# Altium project Master_uC_PCB.PrjPcb (part 1 of 2)
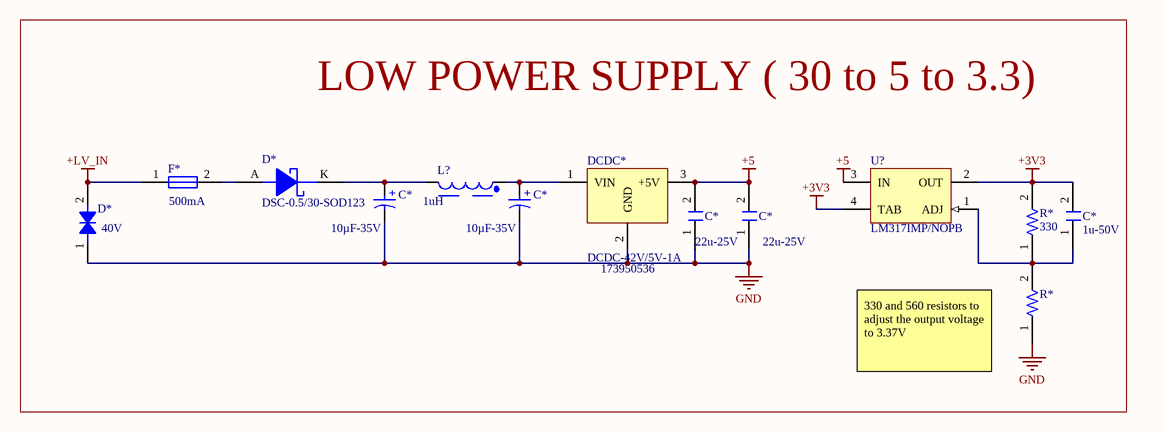
[diagram p0: [1]Supply.SchDoc]
5 sheets, 90 parts. Net scope: flat (ports and power ports of the same name join across sheets).
Sheets:
  [1]Supply.SchDoc
  [2]STM32L4.SchDoc
  [3]CAN_Communication.SchDoc
  [4]isoSPI.SchDoc
  [5]Cooling_Control.SchDoc

## Sheet [1]Supply.SchDoc
size A4; SheetNumber: 3; SheetTotal: 6

### Parts
(Parts that share a designator on the sheet are numbered #1, #2 ... from top to bottom, then left to right.)
?#1  (no value)  (graphical)
C*#1  value 10µF-35V  [865080540004-Footprint-1]  (hidden comment: 865080540004)
C*#2  value 10µF-35V  [865080540004-Footprint-1]  (hidden comment: 865080540004)
C*#3  22u-25V  [0805]
C*#4  22u-25V  [0805]
C*#5  1u-50V  [C0805FNPC-R]
D*#1  DSC-0.5/30-SOD123  [DSC-SOD123]
D*#2  Capacitance: 40V  [DTVS-DO-214AB]  (hidden comment: DTVS-40V-DO-214AB)
DCDC*  DCDC-42V/5V-1A  Part Number: 173950536  [DCDC_Magi3c]
F*  Current Rating: 500mA  [0805]  (hidden comment: MFU0805FF00500P500)
L?  value 1uH  [WE-PD2_4532]  (hidden comment: 7447730)
R*#1  330  [0805]
R*#2  560  [0805]  (value not drawn)
U?  LM317IMP/NOPB  [DCY0004A_M]

### Blocks framed on the sheet
LOW POWER SUPPLY ( 30 to 5 to 3.3): C*#1-C*#5 D*#1 D*#2 DCDC* F* L? R*#1 R*#2 U?

### Nets
+3V3: C*#5.2 R*#1.2 U?.2(OUT) U?.4(TAB)
+5: C*#3.2 C*#4.2 DCDC*.3(+5V) U?.3(IN)
+LV_IN: D*#2.2 F*.1
GND: C*#1.2(N) C*#2.2(N) C*#3.1 C*#4.1 D*#2.1 DCDC*.2(GND) R*#2.1
NetC*#1_1: C*#1.1(P) D*#1.K L?.2
NetC*#2_1: C*#2.1(P) DCDC*.1(VIN) L?.1
NetC*#5_1: C*#5.1 R*#1.1 R*#2.2 U?.1(ADJ)
NetD*#1_A: D*#1.A F*.2

### Notes on the sheet
- (near R*#2) 330 and 560 resistors to adjust the output voltage to 3.37V
- Size:
- Company:
- Project:
- Page Contents:
- Variant:
- Version:
- Checked by:
- Author:
- Sheet
- Date:
- Department:
- of
- (in symbol CMP-001-00019-1) +

### Library data of the parts
?#1 = CMP-00043-6: Standard Title Block
C*#1 C*#2 = CMP-001-00019-1: WCAP-ASLI Aluminum Electrolytic Capacitors; Tolerance: 20%; Ripple Current (AC): 90mA; Voltage Rating: 35V; Min Operating Temperature: -55°C; Max Operating Temperature: 105°C; Case/Package: Radial; Ripple Current: 90mA; Mounting Technology: Surface Mount; RoHS Compliant: Yes
C*#3 C*#4 = CMP-001-00018-1: Ceramic Capacitor, Multilayer, Ceramic, 25V, 20% +Tol, 20% -Tol, X5R, 15% TC, 22uF, Surface Mount, 1210; Value: 22µF; Min Operating Temperature: -55°C; Max Operating Temperature: 85°C; RoHS Compliant: Yes; Pins: 2; Case/Package: 1210; Mounting Technology: Surface Mount; Capacitor Type: Ceramic
C*#5 = CMP-00052-1: Multilayer Ceramic Capacitor, Wcap-Csgp Series, 1 F, 10%, X7R, 50 V, 0805 [2012 Metric] Rohs Compliant: Yes; Manufacturer Part Number 1: 885012207103; Manufacturer 1: Wurth Electronics; Voltage Rating (DC): 50V; Value: 1µF; .Creator: GP; Max Operating Temperature: 85°C; Case/Package: 0805; ComponentLink1Description: http://www.farnell.com/datasheets/1958501.pdf?src-supplier=Farnell; Design Item ID: C1u-50V-0805FNPC-X7R; ComponentLink1URL: http://www.farnell.com/datasheets/1958501.pdf?src-supplier=Farnell; ComponentLink2Description: http://www.farnell.com/datasheets/1958501.pdf?src-supplier=Element14; ComponentLink3URL: https://katalog.we-online.de/pbs/datasheet/885012107003.pdf?src-supplier=Digi-Key; ComponentLink4Description: http://www.farnell.com/datasheets/1958501.pdf?src-supplier=Newark; Width: 0.049inch; RoHS Compliant: Yes; Case Code (Metric): 2012; Source: Passives.SchLib; Category: Ceramic Capacitors; Tolerance: 10%; Pricing 1: 50=0,27200, 250=0,25300, 500=0,22800, 1250=0,20100, 2500=0,17100 (GBP); RoHS: Yes; Mount: Surface Mount; Min Operating Temperature: -55°C; ComponentLink4URL: http://www.farnell.com/datasheets/1958501.pdf?src-supplier=Newark; Dielectric: X7R; ComponentLink3Description: https://katalog.we-online.de/pbs/datasheet/885012107003.pdf?src-supplier=Digi-Key; ComponentLink2URL: http://www.farnell.com/datasheets/1958501.pdf?src-supplier=Element14; REACH SVHC: Unknown; Length: 0.079inch; Packaging: Cut Tape; Thickness: 0.053inch; Stock 1: 5100; Voltage Rating: 50V
D*#1 = CMP-00165-1: VR=30V IF=500mA 30pF P=410mW; Max Reverse Leakage Current: 130uA; .Creator: GP; Max Reverse Voltage (DC): 30V; Element Configuration: Single; Average Rectified Current: 500mA; Peak Non-Repetitive Surge Current: 5.5A; Polarity: Standard; Forward Voltage: 430mV; ComponentLink10Description: https://datasheet.ciiva.com/910/mbr0530-910518.pdf?src-supplier=Digi-Key; ComponentLink1Description: Datasheet; Category: Diode; ComponentLink3Description: https://datasheet.ciiva.com/30479/0900766b810e2512-30479401.pdf?src-supplier=RSComponents; ComponentLink5Description: https://datasheet.ciiva.com/910/mbr0530-910516.pdf?src-supplier=Digi-Key; Stock 1: 9; Weight: 0.03g; Source: Filter components.SchLib; ComponentLink2Description: Where buy it; Series: -; Mount: Surface Mount; Max Repetitive Reverse Voltage (Vrrm): 30V; Pricing 1: 1=0,34400, 10=0,23900, 100=0,12200, 500=0,10000 (USD); Design Item ID: DSC-0.5/30-SOD123; ComponentLink8Description: https://datasheet.ciiva.com/17318/mbr0530-17318568.pdf?src-supplier=Future+Electronics; Current Rating: 500mA; ComponentLink1URL: *; Length: 2.7mm; Max Reverse Current: 130uA; ComponentLink7URL: https://datasheet.ciiva.com/8300/mbr0530-8300905.pdf?src-supplier=Avnet; ComponentLink9URL: https://datasheet.ciiva.com/15144/getdatasheetpartid-86760-15144598.pdf?src-supplier=Verical; Radiation Hardening: No; Height: 1.03mm; ComponentLink4Description: https://datasheet.ciiva.com/34301/974753-34301826.pdf?src-supplier=Jameco; ComponentLink7Description: https://datasheet.ciiva.com/8300/mbr0530-8300905.pdf?src-supplier=Avnet; Package Quantity: 1; Forward Current: 500mA; ComponentLink5URL: https://datasheet.ciiva.com/910/mbr0530-910516.pdf?src-supplier=Digi-Key; Max Surge Current: 5.5A; Lead Free: Lead Free; ComponentLink2URL: *; Max Forward Surge Current (Ifsm): 5.5A; Output Current: 500mA; Voltage Rating (DC): 30V; Contact Plating: Tin,Matte; RoHS Compliant: Yes; REACH SVHC: No SVHC; ComponentLink10URL: https://datasheet.ciiva.com/910/mbr0530-910518.pdf?src-supplier=Digi-Key; ComponentLink4URL: https://datasheet.ciiva.com/34301/974753-34301826.pdf?src-supplier=Jameco; ComponentLink6URL: https://datasheet.ciiva.com/25931/mbr0530-25931989.pdf?src-supplier=Avnet+Europe; ComponentLink6Description: https://datasheet.ciiva.com/25931/mbr0530-25931989.pdf?src-supplier=Avnet+Europe; Width: 1.6mm; ComponentLink3URL: https://datasheet.ciiva.com/30479/0900766b810e2512-30479401.pdf?src-supplier=RSComponents; ComponentLink9Description: https://datasheet.ciiva.com/15144/getdatasheetpartid-86760-15144598.pdf?src-supplier=Verical; ComponentLink8URL: https://datasheet.ciiva.com/17318/mbr0530-17318568.pdf?src-supplier=Future+Electronics
D*#2 = CMP-00157-1: TVS diode [Würth Elektronik] 824551301 TVS diode; Manufacturer: Wurth Electronics; Number of Bidirectional Channels: 1; .Creator: DO; Peak Pulse Current: 62A; Power Line Protection: No; Forward Voltage: 35.05V; Polarity: Bidirectional; Reverse Standoff Voltage: 30V; Peak Pulse Power: 3kW; Clamping Voltage: 48.4V; Stock 1: 1; Category: TVS Diodes; Manufacturer Part Number: 824551301; Resistor Type: Zener; Design Item ID: DTVS-40V-DO-214AB; ComponentLink1URL: http://www.farnell.com/datasheets/2036459.pdf?src-supplier=Element14; Min Operating Temperature: -65°C; ComponentLink2Description: Where buy it; RoHS: Yes; REACH SVHC: Unknown; Pins: 2; ComponentLink2URL: https://www.we-online.com/catalog/en/WE-TVSP?sq=824551301#824551301; Min Breakdown Voltage: 35.05V; RoHS Compliant: Yes; Pricing 1: 10=1,72500, 50=1,54700, 100=1,45300, 250=1,35100, 500=1,15000 (USD); Max Operating Temperature: 150°C; Packaging: Cut Tape; Source: Filter components.SchLib; ComponentLink1Description: http://www.farnell.com/datasheets/2036459.pdf?src-supplier=Element14; Mount: Surface Mount
DCDC* = CMP-00116-1: Würth Elektronik 8-42V to 5V 1A DC-DC; Manufacturer 1: Wurth Electronics; Manufacturer Part Number 1: 173010542; Efficiency: 93%; Min Input Voltage: 8V; .Creator: DR; Max Input Voltage: 42V; Number of Outputs: 1; Packaging: Rail/Tube; RoHS Compliant: Yes; RoHS: Yes; Voltage - Output 1: 5V; Stock 1: 1; ComponentLink3Description: https://katalog.we-online.de/pm/datasheet/173010542.pdf?src-supplier=Digi-Key; Max Output Current: 1A; Min Operating Temperature: -40°C; Features: UVLO,OCP,OTP,SCP; Design Item ID: DCDC-42V/5V-1A; Pricing 1: 1=12,22500, 8=10,96900, 21=10,68900 (USD); ComponentLink3URL: https://katalog.we-online.de/pm/datasheet/173010542.pdf?src-supplier=Digi-Key; Max Operating Temperature: 85°C; ComponentLink2Description: http://www.farnell.com/datasheets/2192895.pdf?src-supplier=Newark; ComponentLink1URL: http://www.farnell.com/datasheets/2192895.pdf?src-supplier=Farnell; ComponentLink1Description: http://www.farnell.com/datasheets/2192895.pdf?src-supplier=Farnell; Source: Semiconductor.SchLib; ComponentLink2URL: http://www.farnell.com/datasheets/2192895.pdf?src-supplier=Newark; Mount: Through Hole
F* = CMP-001-00020-1: Fuse, 24 Milliohms to 660 Milliohms (Cold) @ 0.1, 32 V, 0805, 15 C, 35 C; Value: 0.5A-50V; Max Operating Temperature: 125°C; Pins: 2; Case/Package: 0805; Mounting Technology: Surface Mount,PCB; RoHS Compliant: Yes; Min Operating Temperature: 15°C
L? = CMP-006-00005-1: General Purpose Inductor, 1uH, 20%, 1 Element, Nickel-zinc Ferrite-Core, SMD, 1816; Self Resonant Frequency: 110MHz; Max Current Rating: 4A; RoHS Compliant: Yes; Tolerance: 20%; Min Operating Temperature: -40°C; Pins: 2; Max Operating Temperature: 125°C
R*#1 = CMP-009-00024-1: Fixed Resistor, Metal Glaze/thick Film, 0.5W, 330ohm, 150V, 1% +/-Tol, 100ppm/Cel, Surface Mount, 0805; Power: 500mW; Max Operating Temperature: 155°C; Min Operating Temperature: -55°C; Pins: 2; RoHS Compliant: Yes; Value: 330; Case/Package: 0805; Mounting Technology: Surface Mount; Tolerance: 1%
R*#2 = CMP-009-00025-1: Fixed Resistor, Metal Glaze/thick Film, 0.5W, 560ohm, 150V, 1% +/-Tol, 100ppm/Cel, Surface Mount, 0805; Power: 500mW; Mounting Technology: Surface Mount; Tolerance: 1%; Case/Package: 0805; Max Operating Temperature: 155°C; RoHS Compliant: Yes; Min Operating Temperature: -55°C; Pins: 2; Value: 560
U? = CMP-019-00004-1: Linear Voltage Regulator IC Positive Adjustable 1 Output 1.25 V ~ 37 V 1A SOT-223-4

## Sheet [2]STM32L4.SchDoc
size A4; SheetNumber: 2; SheetTotal: 6
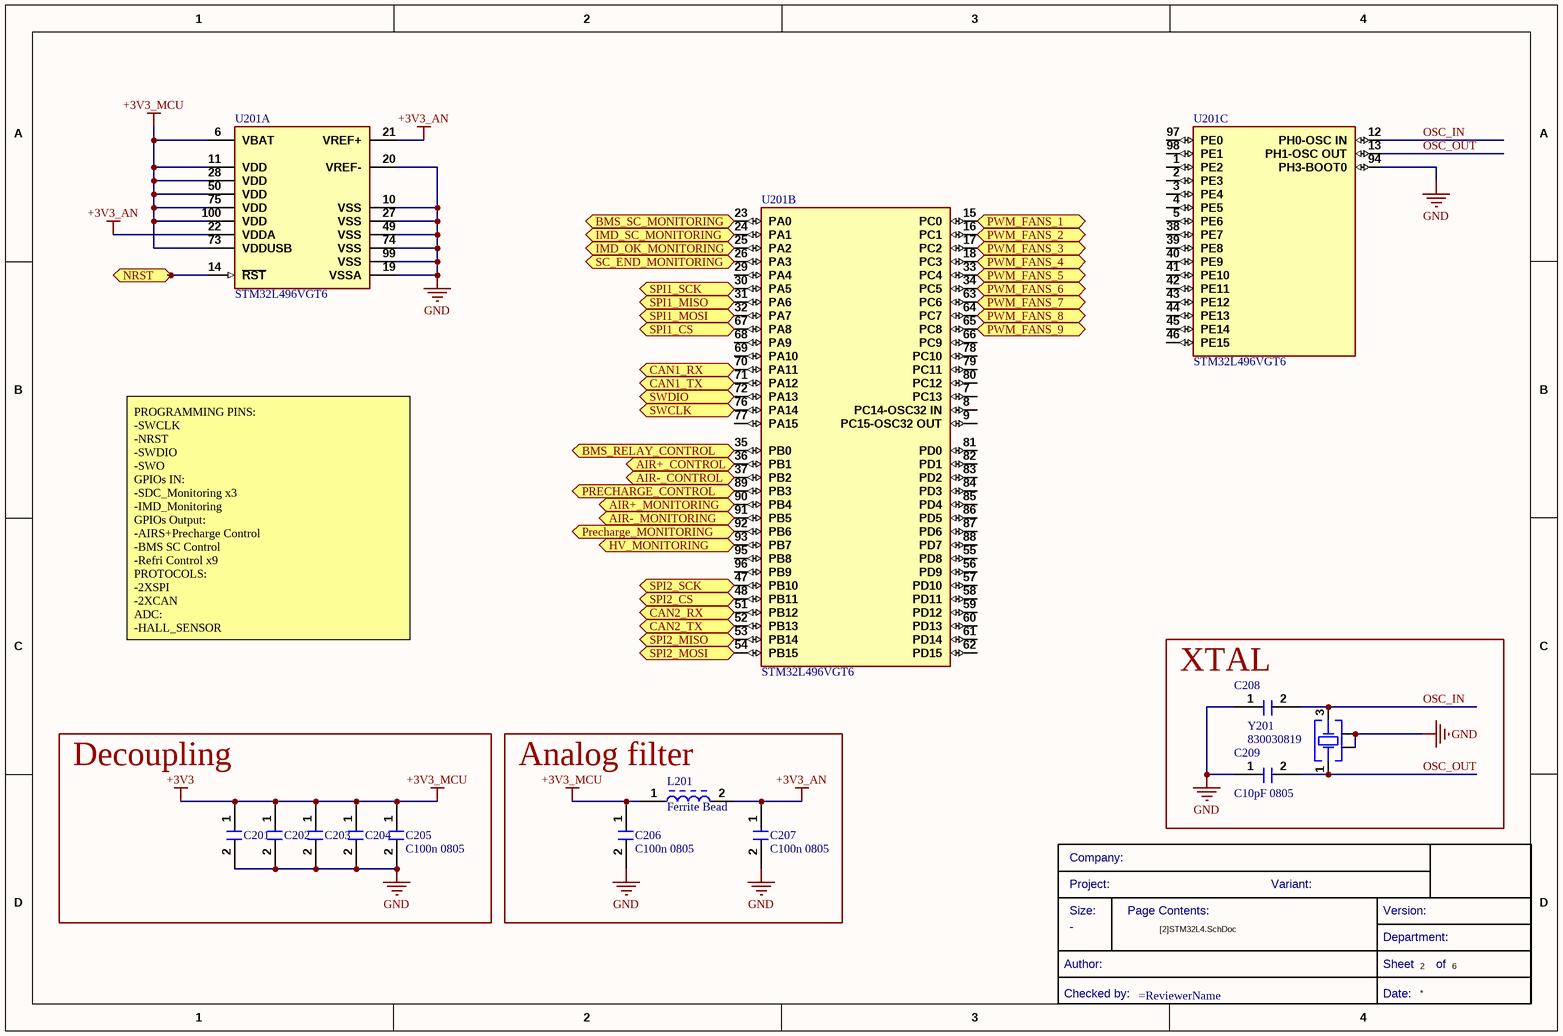
[diagram p1: [2]STM32L4.SchDoc]

### Parts
(Parts that share a designator on the sheet are numbered #1, #2 ... from top to bottom, then left to right.)
?#2  (no value)  (graphical)
C201  C100n 0805  [C0805FNPC-R]  (value not drawn)
C202  C100n 0805  [C0805FNPC-R]  (value not drawn)
C203  C100n 0805  [C0805FNPC-R]  (value not drawn)
C204  C100n 0805  [C0805FNPC-R]  (value not drawn)
C205  C100n 0805  [C0805FNPC-R]
C206  C100n 0805  [C0805FNPC-R]
C207  C100n 0805  [C0805FNPC-R]
C208  C10pF 0805  [WCAP-CSGP_0805_L2W1.25H0.6_Reflow]
C209  C10pF 0805  [WCAP-CSGP_0805_L2W1.25H0.6_Reflow]  (value not drawn)
L201  Ferrite Bead  [L_Ferrite_bead_0805]
U201  STM32L496VGT6  [FP-LQFP100-1L-IPC_A]  (parts A,B,C of 3)
Y201  830030819  [WE-XTAL_CFPX-104]

### Blocks framed on the sheet
XTAL: C208 C209 Y201
Decoupling: C201-C205
Analog filter: C206 C207 L201

### Ports
AIR+_CONTROL (bidir, see Master_uC_PCB.SchDoc[1B]), AIR+_MONITORING (bidir, see Master_uC_PCB.SchDoc[1A]), AIR-_CONTROL (bidir, see Master_uC_PCB.SchDoc[1B]), AIR-_MONITORING (bidir, see Master_uC_PCB.SchDoc[1A]), BMS_RELAY_CONTROL (bidir, see Master_uC_PCB.SchDoc[1A]), BMS_SC_MONITORING (bidir, see Master_uC_PCB.SchDoc[1A]), CAN1_RX (bidir, see Master_uC_PCB.SchDoc[2A], [3]CAN_Communication[1A]), CAN1_TX (bidir, see Master_uC_PCB.SchDoc[2A], [3]CAN_Communication[1B]), CAN2_RX (bidir, see Master_uC_PCB.SchDoc[2A], [3]CAN_Communication[1A]), CAN2_TX (bidir, see Master_uC_PCB.SchDoc[2A], [3]CAN_Communication[1A]), HV_MONITORING (bidir, see Master_uC_PCB.SchDoc[1A]), IMD_OK_MONITORING (bidir, see Master_uC_PCB.SchDoc[1A]), IMD_SC_MONITORING (bidir, see Master_uC_PCB.SchDoc[1A]), NRST (bidir, see Master_uC_PCB.SchDoc[2B]), PRECHARGE_CONTROL (bidir, see Master_uC_PCB.SchDoc[1B]), Precharge_MONITORING (bidir, see Master_uC_PCB.SchDoc[1A]), PWM_FANS_1 (bidir, see Master_uC_PCB.SchDoc[1B], [5]Cooling_Control[4A]), PWM_FANS_2 (bidir, see Master_uC_PCB.SchDoc[1B], [5]Cooling_Control[4A]), PWM_FANS_3 (bidir, see Master_uC_PCB.SchDoc[1B], [5]Cooling_Control[4A]), PWM_FANS_4 (bidir, see Master_uC_PCB.SchDoc[1B], [5]Cooling_Control[4A]), PWM_FANS_5 (bidir, see Master_uC_PCB.SchDoc[1B], [5]Cooling_Control[4B]), PWM_FANS_6 (bidir, see Master_uC_PCB.SchDoc[1B], [5]Cooling_Control[4B]), PWM_FANS_7 (bidir, see Master_uC_PCB.SchDoc[1B], [5]Cooling_Control[4B]), PWM_FANS_8 (bidir, see Master_uC_PCB.SchDoc[1B], [5]Cooling_Control[4B]), PWM_FANS_9 (bidir, see Master_uC_PCB.SchDoc[1B], [5]Cooling_Control[4B]), SC_END_MONITORING (bidir, see Master_uC_PCB.SchDoc[1A]), SPI1_CS (bidir, see Master_uC_PCB.SchDoc[2A], [4]isoSPI[1A]), SPI1_MISO (bidir, see Master_uC_PCB.SchDoc[2A], [4]isoSPI[1A]), SPI1_MOSI (bidir, see Master_uC_PCB.SchDoc[2A], [4]isoSPI[1A]), SPI1_SCK (bidir, see Master_uC_PCB.SchDoc[2A], [4]isoSPI[1A]), SPI2_CS (bidir, see Master_uC_PCB.SchDoc[2B], [4]isoSPI[1B]), SPI2_MISO (bidir, see Master_uC_PCB.SchDoc[2B], [4]isoSPI[1B]), SPI2_MOSI (bidir, see Master_uC_PCB.SchDoc[2B], [4]isoSPI[1B]), SPI2_SCK (bidir, see Master_uC_PCB.SchDoc[2A], [4]isoSPI[1A]), SWCLK (bidir, see Master_uC_PCB.SchDoc[2B]), SWDIO (bidir, see Master_uC_PCB.SchDoc[2B])

### Nets
+3V3: C201.1 C202.1 C203.1 C204.1 C205.1 C206.1 L201.1 U201.6(VBAT) U201.11(VDD) U201.28(VDD) U201.50(VDD) U201.73(VDDUSB) U201.75(VDD) U201.100(VDD)  [also labelled +3V3_MCU]
+3V3_AN: C207.1 L201.2 U201.21(VREF+) U201.22(VDDA)
GND: C201.2 C202.2 C203.2 C204.2 C205.2 C206.2 C207.2 C208.1 C209.1 U201.10(VSS) U201.19(VSSA) U201.20(VREF-) U201.27(VSS) U201.49(VSS) U201.74(VSS) U201.94(PH3-BOOT0) U201.99(VSS) Y201.2(GND_&_Lid) Y201.4(GND_&_Lid)
CAN1_RX: U201.70(PA11) ; port CAN1_RX
CAN1_TX: U201.71(PA12) ; port CAN1_TX
CAN2_RX: U201.51(PB12) ; port CAN2_RX
CAN2_TX: U201.52(PB13) ; port CAN2_TX
OSC_IN: C208.2 U201.12(PH0-OSC_IN) Y201.3(Crystal)
OSC_OUT: C209.2 U201.13(PH1-OSC_OUT) Y201.1(Crystal)
PWM_FANS_1: U201.15(PC0) ; port PWM_FANS_1
PWM_FANS_2: U201.16(PC1) ; port PWM_FANS_2
PWM_FANS_3: U201.17(PC2) ; port PWM_FANS_3
PWM_FANS_4: U201.18(PC3) ; port PWM_FANS_4
PWM_FANS_5: U201.33(PC4) ; port PWM_FANS_5
PWM_FANS_6: U201.34(PC5) ; port PWM_FANS_6
PWM_FANS_7: U201.63(PC6) ; port PWM_FANS_7
PWM_FANS_8: U201.64(PC7) ; port PWM_FANS_8
PWM_FANS_9: U201.65(PC8) ; port PWM_FANS_9
SPI1_CS: U201.67(PA8) ; port SPI1_CS
SPI1_PICO: U201.32(PA7) ; port SPI1_MOSI
SPI1_POCI: U201.31(PA6) ; port SPI1_MISO
SPI1_SCK: U201.30(PA5) ; port SPI1_SCK
SPI2_PICO: U201.54(PB15) ; port SPI2_MOSI
SPI2_POCI: U201.53(PB14) ; port SPI2_MISO
SPI2_SCK: U201.47(PB10) ; port SPI2_SCK
SPI12_CS: U201.48(PB11) ; port SPI2_CS
NetU201_14: U201.14(~{RST}) ; port NRST
NetU201_23: U201.23(PA0) ; port BMS_SC_MONITORING
NetU201_24: U201.24(PA1) ; port IMD_SC_MONITORING
NetU201_25: U201.25(PA2) ; port IMD_OK_MONITORING
NetU201_26: U201.26(PA3) ; port SC_END_MONITORING
NetU201_35: U201.35(PB0) ; port BMS_RELAY_CONTROL
NetU201_36: U201.36(PB1) ; port AIR+_CONTROL
NetU201_37: U201.37(PB2) ; port AIR-_CONTROL
NetU201_72: U201.72(PA13) ; port SWDIO
NetU201_76: U201.76(PA14) ; port SWCLK
NetU201_89: U201.89(PB3) ; port PRECHARGE_CONTROL
NetU201_90: U201.90(PB4) ; port AIR+_MONITORING
NetU201_91: U201.91(PB5) ; port AIR-_MONITORING
NetU201_92: U201.92(PB6) ; port Precharge_MONITORING
NetU201_93: U201.93(PB7) ; port HV_MONITORING

Not connected (* = marked no-connect by the designer): U201 1(PE2) 2(PE3) 3(PE4) 4(PE5) 5(PE6) 7(PC13) 8(PC14-OSC32_IN) 9(PC15-OSC32_OUT) 29(PA4) 38(PE7) 39(PE8) 40(PE9) 41(PE10) 42(PE11) 43(PE12) 44(PE13) 45(PE14) 46(PE15) 55(PD8) 56(PD9) 57(PD10) 58(PD11) 59(PD12) 60(PD13) 61(PD14) 62(PD15) 66(PC9) 68(PA9) 69(PA10) 77(PA15) 78(PC10) 79(PC11) 80(PC12) 81(PD0) 82(PD1) 83(PD2) 84(PD3) 85(PD4) 86(PD5) 87(PD6) 88(PD7) 95(PB8) 96(PB9) 97(PE0) 98(PE1)

### Notes on the sheet
- PROGRAMMING PINS:
  -SWCLK
  -NRST
  -SWDIO
  -SWO
  GPIOs IN:
  -SDC_Monitoring x3
  -IMD_Monitoring
  GPIOs Output:
  -AIRS+Precharge Control
  -BMS SC Control
  -Refri Control x9
  PROTOCOLS:
  -2XSPI
  -2XCAN
  ADC:
  -HALL_SENSOR
- Size:
- Company:
- Project:
- Page Contents:
- Variant:
- Version:
- Checked by:
- Author:
- Sheet
- Date:
- Department:
- of

### Library data of the parts
?#2 = CMP-00043-6: Standard Title Block
C201-C207 = CMP-00063-1: Cap, 0.1ΜF, 50V, 10%, X7R, 0805; Manufacturer 1: Wurth Electronics; Manufacturer Part Number 1: 885012207098; Value: 100nF; .Creator: DR; Pricing 1: 100=0,10200, 500=0,07100, 2000=0,06100 (GBP); ComponentLink1URL: http://www.farnell.com/datasheets/1958498.pdf?src-supplier=Farnell; Design Item ID: C100n-50V-0805FNPC-X7R; Voltage Rating (DC): 50V; Voltage Rating: 50V; Max Operating Temperature: 125°C; RoHS: Yes; Case Code (Metric): 2012; Mount: Surface Mount; REACH SVHC: Unknown; Stock 1: 8000; Source: Passives.SchLib; Tolerance: 10%; RoHS Compliant: Yes; Dielectric: X7R; ComponentLink2Description: http://www.farnell.com/datasheets/1958498.pdf?src-supplier=Element14; ComponentLink2URL: http://www.farnell.com/datasheets/1958498.pdf?src-supplier=Element14; Min Operating Temperature: -55°C; Width: 0.049inch; Category: Ceramic Capacitors; Thickness: 0.035inch; Length: 0.079inch; ComponentLink3URL: https://katalog.we-online.de/pbs/datasheet/885012207098.pdf?src-supplier=Digi-Key; Case/Package: 0805; ComponentLink3Description: https://katalog.we-online.de/pbs/datasheet/885012207098.pdf?src-supplier=Digi-Key; Packaging: Cut Tape; ComponentLink1Description: http://www.farnell.com/datasheets/1958498.pdf?src-supplier=Farnell; ComponentLink4Description: http://www.farnell.com/datasheets/1958498.pdf?src-supplier=Newark; ComponentLink4URL: http://www.farnell.com/datasheets/1958498.pdf?src-supplier=Newark
C208 C209 = CMP-001-00012-2: Ceramic Capacitor, Multilayer, Ceramic, 50V, 5% +Tol, 5% -Tol, C0G, 30ppm/Cel TC, 0.00001uF, Surface Mount, 0805. 885012007051; Pins: 2; RoHS Compliant: Yes; Capacitor Type: Ceramic
L201 = CMP-00166-1: Manufacturer Part Number: BLM18EG331TN1D; Manufacturer: Murata; .Creator: GP; Tolerance: 25%; Impedance: 330R; Max DC Current: 500mA; Resistance: 0.21; Number of Circuits: 1; DC Resistance (DCR): 210mR; Material: Ferrite,Steel; Test Frequency: 100MHz; RoHS: Yes; Case Code (Metric): 1608; ComponentLink6URL: https://datasheet.ciiva.com/3082/l0110s0101blm18e-3082714.pdf?src-supplier=Avnet; ComponentLink7URL: https://datasheet.ciiva.com/6211/l0110s0101blm18e-6211470.pdf?src-supplier=Digi-Key; Width: 0.8mm; ComponentLink6Description: https://datasheet.ciiva.com/3082/l0110s0101blm18e-3082714.pdf?src-supplier=Avnet; Series: BLM18E; Stock 1: 20037; Core Material: Ferrite; Packaging: Tape and Reel; Max Operating Temperature: 125°C; Case/Package: 0603; ComponentLink8URL: https://datasheet.ciiva.com/6211/l0110s0101blm18e-6211471.pdf?src-supplier=Digi-Key; Case Code (Imperial): 0603; Lead Free: Lead Free; ComponentLink3Description: https://datasheet.ciiva.com/41449/001172267-da-01-en-drossel-0603-330r-1-6x0-8mm-4000st-41449581.pdf?src-supplier=Conrad; Height: 0.8mm; REACH SVHC: No SVHC; ComponentLink1URL: https://datasheet.ciiva.com/1467/5169-1467232.pdf?src-supplier=Element14; Number of Pins: 2; Source: Filter components.SchLib; ComponentLink1Description: https://datasheet.ciiva.com/1467/5169-1467232.pdf?src-supplier=Element14; Depth: 0.8mm; Termination: SMD/SMT; Package Quantity: 1; Min Operating Temperature: -55°C; ComponentLink7Description: https://datasheet.ciiva.com/6211/l0110s0101blm18e-6211470.pdf?src-supplier=Digi-Key; Design Item ID: L_Ferrite_bead_782853561; Length: 1.6mm; ComponentLink4Description: https://datasheet.ciiva.com/1467/5169-1467233.pdf?src-supplier=Element14; ComponentLink8Description: https://datasheet.ciiva.com/6211/l0110s0101blm18e-6211471.pdf?src-supplier=Digi-Key; Current Rating: 500mA; RoHS Compliant: Yes; ComponentLink2Description: https://datasheet.ciiva.com/11795/0900766b811b5866-11795405.pdf?src-supplier=RSComponents; Number of Lines: 1; ComponentLink2URL: https://datasheet.ciiva.com/11795/0900766b811b5866-11795405.pdf?src-supplier=RSComponents; Pricing 1: 1=0,23000, 10=0,17500, 25=0,14520, 50=0,12520, 100=0,11260, 250=0,09508, 500=0,08508, 1000=0,07257 (USD); Max Current Rating: 500mA; ComponentLink5URL: https://datasheet.ciiva.com/1561/5169-1561345.pdf?src-supplier=Newark; ComponentLink4URL: https://datasheet.ciiva.com/1467/5169-1467233.pdf?src-supplier=Element14; Category: Ferrite Beads and Chips; ComponentLink3URL: https://datasheet.ciiva.com/41449/001172267-da-01-en-drossel-0603-330r-1-6x0-8mm-4000st-41449581.pdf?src-supplier=Conrad; ComponentLink5Description: https://datasheet.ciiva.com/1561/5169-1561345.pdf?src-supplier=Newark
U201 = CMP-031-00008-1: RISC Microcontroller, 32-Bit, FLASH, CORTEX-M4 CPU, 80MHz, CMOS, PQFP100; Max Supply Voltage: 3.6V; Min Supply Voltage: 1.71V; RoHS Compliant: Yes; Case/Package: LFQFP; Max Operating Temperature: 85°C; Pins: 100; Min Operating Temperature: -40°C
Y201 = CMP-003-00000-1: WE-XTAL Quartz Crystal, SMT, CFPX-104, 16MHz, +/-50ppm; Manufacturer: Wurth Elektronik; Load Capacitance: 18pF; ComponentLink2Description: Datasheet Link; Manufacturer Part Number: 830030819; Match Code: WE-XTAL; ComponentLink1Description: Website Link; Width: 3.2mm; Source: WE-XTAL.SchLib; Category: Crystals; Mount: Surface Mount; Frequency: 16MHz; Operating Temperature Max: 60°C; Frequency Tolerance: +/-50ppm; Pins: 4; Design Item ID: 830030819; Component Type: Standard; Length: 5mm; Height: 1mm; Frequency Stability: +/-50ppm; Operating Temperature Min: -10°C; ComponentLink2URL: https://www.we-online.com/redexpert/spec/830030819?ad; ComponentLink1URL: https://www.we-online.com/redexpert/article/830030819?ad; Packaging: Tape and Reel; Case/Package: CFPX-104

## Sheet [3]CAN_Communication.SchDoc
size A4; SheetNumber: 4; SheetTotal: 6
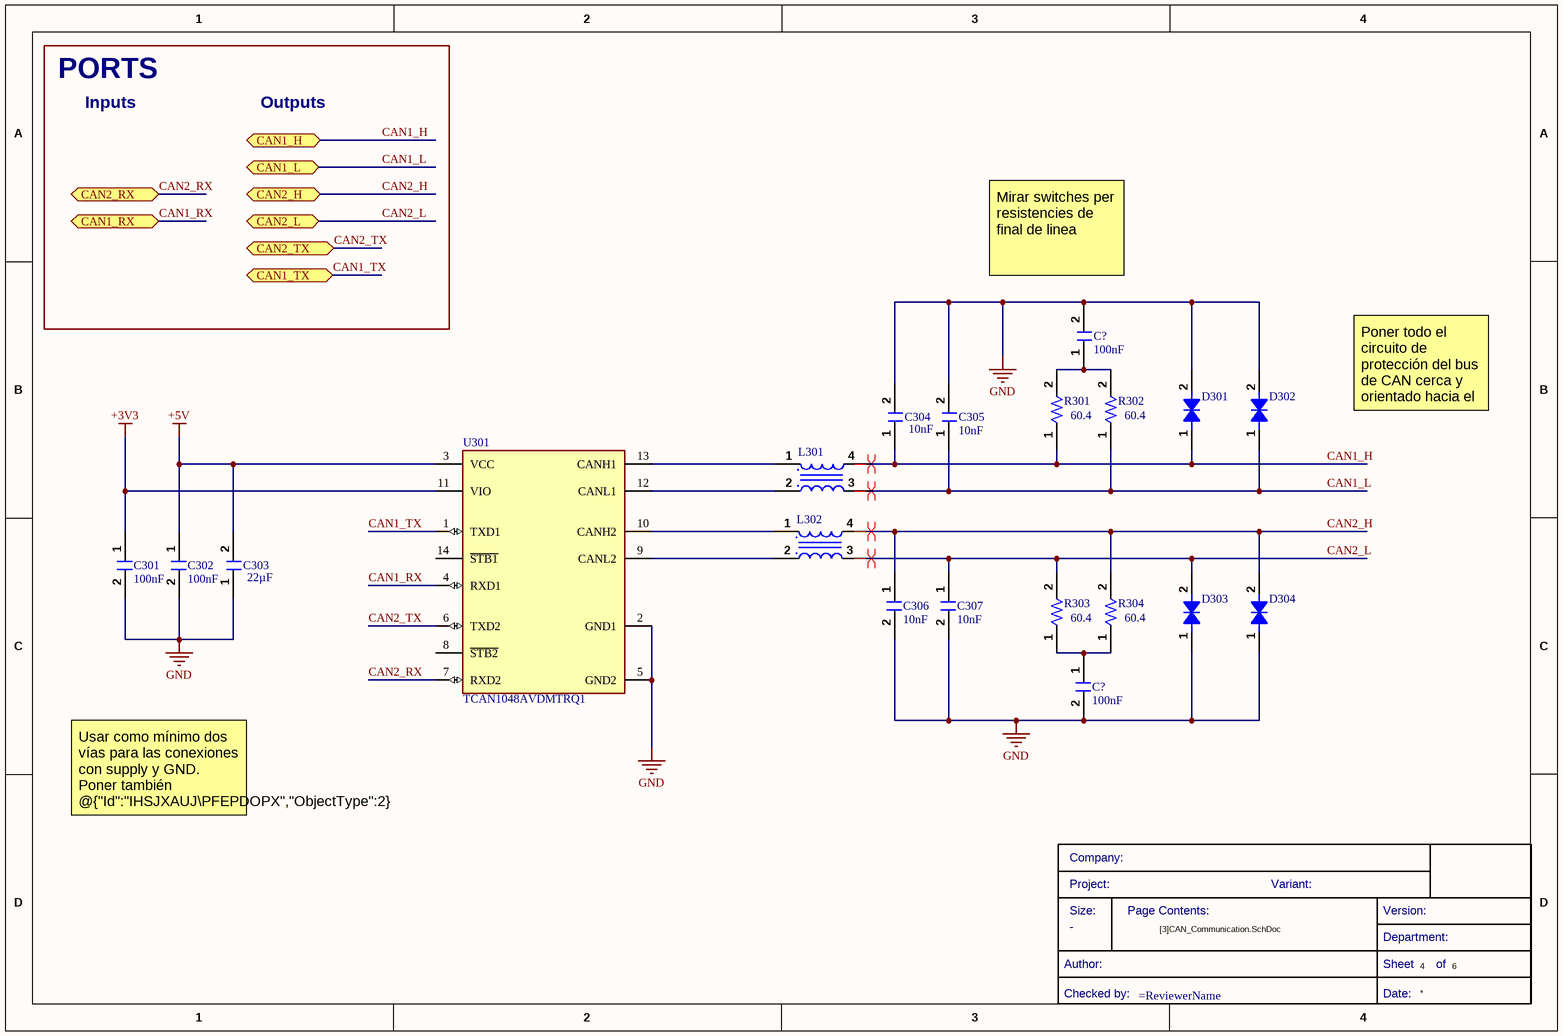
[diagram p2: [3]CAN_Communication.SchDoc]

### Parts
(Parts that share a designator on the sheet are numbered #1, #2 ... from top to bottom, then left to right.)
?#3  (no value)  (graphical)
C301  value 100nF  [C0805FNPC-R]  (hidden comment: C100n-50V-0805FNPC-X7R)
C302  value 100nF  [C0805FNPC-R]  (hidden comment: C100n-50V-0805FNPC-X7R)
C303  value 22µF  [C0805FNPC-W]  (hidden comment: C22u-10V-0805FNPC-X5R)
C304  value 10nF  [WCAP-CSGP_0805_L2W1.25H0.8_Reflow]  (hidden comment: C10n-100V-0805)
C305  value 10nF  [WCAP-CSGP_0805_L2W1.25H0.8_Reflow]  (hidden comment: C10n-100V-0805)
C306  value 10nF  [WCAP-CSGP_0805_L2W1.25H0.8_Reflow]  (hidden comment: C10n-100V-0805)
C307  value 10nF  [WCAP-CSGP_0805_L2W1.25H0.8_Reflow]  (hidden comment: C10n-100V-0805)
C?#1  value 100nF  [C0805FNPC-R]  (hidden comment: C100n-50V-0805FNPC-X7R)
C?#2  value 100nF  [C0805FNPC-R]  (hidden comment: C100n-50V-0805FNPC-X7R)
D301  DTVS-6V-DO-214AC  [DTVS-DO-214AC]  (value not drawn)
D302  DTVS-6V-DO-214AC  [DTVS-DO-214AC]  (value not drawn)
D303  DTVS-6V-DO-214AC  [DTVS-DO-214AC]  (value not drawn)
D304  DTVS-6V-DO-214AC  [DTVS-DO-214AC]  (value not drawn)
L301  CMC_10u_1.6A  [CMC_10u_1.6A]  (value not drawn)
L302  CMC_10u_1.6A  [CMC_10u_1.6A]  (value not drawn)
R301  value 60.4  [R0805FTK]  (hidden comment: R60-0805FTN)
R302  value 60.4  [R0805FTK]  (hidden comment: R60-0805FTN)
R303  value 60.4  [R0805FTK]  (hidden comment: R60-0805FTN)
R304  value 60.4  [R0805FTK]  (hidden comment: R60-0805FTN)
U301  TCAN1048AVDMTRQ1  [SOIC127P600X175-14N]

### Ports
CAN1_H (bidir, see Master_uC_PCB.SchDoc[1D]), CAN1_L (bidir, see Master_uC_PCB.SchDoc[1D]), CAN1_RX (bidir, see Master_uC_PCB.SchDoc[2D], [2]STM32L4[2B]), CAN1_TX (bidir, see Master_uC_PCB.SchDoc[2D], [2]STM32L4[2B]), CAN2_H (bidir, see Master_uC_PCB.SchDoc[1D]), CAN2_L (bidir, see Master_uC_PCB.SchDoc[1D]), CAN2_RX (bidir, see Master_uC_PCB.SchDoc[2D], [2]STM32L4[2C]), CAN2_TX (bidir, see Master_uC_PCB.SchDoc[2D], [2]STM32L4[2C])

### Nets
+3V3: C301.1 U301.11(VIO)
+5V: C302.1 C303.2 U301.3(VCC)
GND: C301.2 C302.2 C303.1 C304.2 C305.2 C306.2 C307.2 C?#1.2 C?#2.2 D301.2 D302.2 D303.1 D304.1 U301.2(GND1) U301.5(GND2)
CAN1_H: C304.1 D301.1 L301.4(4_OUT) R301.1 ; port CAN1_H
CAN1_L: C305.1 D302.1 L301.3(3_OUT) R302.1 ; port CAN1_L
CAN1_RX: U301.4(RXD1) ; port CAN1_RX
CAN1_TX: U301.1(TXD1) ; port CAN1_TX
CAN2_H: C306.1 D304.2 L302.4(4_OUT) R304.2 ; port CAN2_H
CAN2_L: C307.1 D303.2 L302.3(3_OUT) R303.2 ; port CAN2_L
CAN2_RX: U301.7(RXD2) ; port CAN2_RX
CAN2_TX: U301.6(TXD2) ; port CAN2_TX
NetC?#1_1: C?#1.1 R301.2 R302.2
NetC?#2_1: C?#2.1 R303.1 R304.1
NetL301_1: L301.1(1_IN) U301.13(CANH1)
NetL301_2: L301.2(2_IN) U301.12(CANL1)
NetL302_1: L302.1(1_IN) U301.10(CANH2)
NetL302_2: L302.2(2_IN) U301.9(CANL2)

Not connected (* = marked no-connect by the designer): U301 8(~{STB2}) 14(~{STB1})

### Layout directives
differential pair: (no net found under the mark)

### Notes on the sheet
- PORTS
- Inputs
- Outputs
- Mirar switches per resistencies de final de linea
- Poner todo el circuito de protección del bus de CAN cerca y orientado hacia el conector.
- Usar como mínimo dos vías para las conexiones con supply y GND. Poner también @{"Id":"IHSJXAUJ\PFEPDOPX","ObjectType":2} @{"Id":"IHSJXAUJ\DLGJLBMK","ObjectType":2} y @{"Id":"IHSJXAUJ\AUUMIETI","ObjectType":2} cerca de los pins de VCC y VIO.
- Size:
- Company:
- Project:
- Page Contents:
- Variant:
- Version:
- Checked by:
- Author:
- Sheet
- Date:
- Department:
- of

### Library data of the parts
?#3 = CMP-00043-6: Standard Title Block
C301 C302 C?#1 C?#2 = CMP-00063-1: Cap, 0.1ΜF, 50V, 10%, X7R, 0805; Manufacturer 1: Wurth Electronics; Manufacturer Part Number 1: 885012207098; .Creator: DR; Pricing 1: 100=0,10200, 500=0,07100, 2000=0,06100 (GBP); ComponentLink1URL: http://www.farnell.com/datasheets/1958498.pdf?src-supplier=Farnell; Design Item ID: C100n-50V-0805FNPC-X7R; Voltage Rating (DC): 50V; Voltage Rating: 50V; Max Operating Temperature: 125°C; RoHS: Yes; Case Code (Metric): 2012; Mount: Surface Mount; REACH SVHC: Unknown; Stock 1: 8000; Source: Passives.SchLib; Tolerance: 10%; RoHS Compliant: Yes; Dielectric: X7R; ComponentLink2Description: http://www.farnell.com/datasheets/1958498.pdf?src-supplier=Element14; ComponentLink2URL: http://www.farnell.com/datasheets/1958498.pdf?src-supplier=Element14; Min Operating Temperature: -55°C; Width: 0.049inch; Category: Ceramic Capacitors; Thickness: 0.035inch; Length: 0.079inch; ComponentLink3URL: https://katalog.we-online.de/pbs/datasheet/885012207098.pdf?src-supplier=Digi-Key; Case/Package: 0805; ComponentLink3Description: https://katalog.we-online.de/pbs/datasheet/885012207098.pdf?src-supplier=Digi-Key; Packaging: Cut Tape; ComponentLink1Description: http://www.farnell.com/datasheets/1958498.pdf?src-supplier=Farnell; ComponentLink4Description: http://www.farnell.com/datasheets/1958498.pdf?src-supplier=Newark; ComponentLink4URL: http://www.farnell.com/datasheets/1958498.pdf?src-supplier=Newark
C303 = CMP-00058-1: Multilayer Ceramic Capacitor, Wcap-Csgp Series, 22 F, 20%, X5R, 10 V, 0805 [2012 Metric] Rohs Compliant: Yes; Manufacturer: Wurth Electronics; Manufacturer Part Number: 885012107011; Voltage Rating (DC): 10V; .Creator: DR; Length: 0.079inch; ComponentLink3URL: http://www.farnell.com/datasheets/1958453.pdf?src-supplier=Element14; ComponentLink1Description: http://www.farnell.com/datasheets/1958453.pdf?src-supplier=Farnell; ComponentLink2Description: http://www.farnell.com/datasheets/1958453.pdf?src-supplier=Newark; Dielectric: X5R; ComponentLink5Description: Where buy it; Thickness: 0.057inch; Min Operating Temperature: -55°C; RoHS Compliant: Yes; ComponentLink2URL: http://www.farnell.com/datasheets/1958453.pdf?src-supplier=Newark; Case Code (Metric): 2012; Tolerance: 20%; ComponentLink5URL: https://www.we-online.com/catalog/en/WCAP-CSGP-10VDC#885012107011; Source: Passives.SchLib; ComponentLink1URL: http://www.farnell.com/datasheets/1958453.pdf?src-supplier=Farnell; Category: Ceramic Capacitors; ComponentLink4URL: https://katalog.we-online.de/pbs/datasheet/885012107011.pdf?src-supplier=Digi-Key; RoHS: Yes; ComponentLink4Description: https://katalog.we-online.de/pbs/datasheet/885012107011.pdf?src-supplier=Digi-Key; Design Item ID: C22u-10V-0805FNPC-X5R; ComponentLink3Description: http://www.farnell.com/datasheets/1958453.pdf?src-supplier=Element14; Mount: Surface Mount; REACH SVHC: Unknown; Width: 0.049inch; Max Operating Temperature: 85°C; Case/Package: 0805; Stock 1: 8800; Pricing 1: 20=0,15300, 100=0,40300, 200=0,37700, 500=0,35100, 1000=0,31700 (GBP); Voltage Rating: 10V; Packaging: Cut Tape
C304-C307 = CMP-001-00007-2: Cap Cer 10000PF 100V X7R 0805
D301-D304 = CMP-00154-1: TVS diode [Würth Elektronik] 824501600 TVS diode; Manufacturer: Wurth Electronics; Power Line Protection: No; Forward Voltage: 7.02V; Number of Bidirectional Channels: 1; Peak Pulse Current: 38.8A; Reverse Standoff Voltage: 6V; .Creator: DO; Polarity: Bidirectional; Peak Pulse Power: 400W; Clamping Voltage: 10.3V; ComponentLink2Description: http://www.farnell.com/datasheets/2036401.pdf?src-supplier=Element14; Source: Filter components.SchLib; ComponentLink3URL: https://katalog.we-online.de/pbs/datasheet/824501600.pdf?src-supplier=Digi-Key; Mount: Surface Mount; Design Item ID: DTVS-6V-DO-214AC; ComponentLink3Description: https://katalog.we-online.de/pbs/datasheet/824501600.pdf?src-supplier=Digi-Key; RoHS: Yes; Resistor Type: Zener; REACH SVHC: Unknown; Pins: 2; Min Breakdown Voltage: 7.02V; Min Operating Temperature: -65°C; ComponentLink1URL: https://www.we-online.com/catalog/en/WE-TVSP?sq=824501600#824501600; Stock 1: 780; Pricing 1: 1=0,28000, 10=0,26100, 50=0,26100, 100=0,23400, 500=0,20400, 1000=0,17400, 10000=0,17400 (USD); ComponentLink2URL: http://www.farnell.com/datasheets/2036401.pdf?src-supplier=Element14; Category: TVS Diodes; ComponentLink1Description: Where buy it; Manufacturer Part Number: 824501600; Packaging: Cut Tape; RoHS Compliant: Yes; Max Operating Temperature: 150°C
L301 L302 = CMP-00160-1: Common Mode Chokes Dual 10uH 920Ohm 1kHz 1.6A 80mOhm DCR SMD T/R; Manufacturer: Wurth Electronics; Manufacturer Part Number: 744226; Voltage Rating: 80V; Inductance Tolerance: 30%; Number of Lines: 2; Impedance: 920R; Core Material: Ferrite; DC Resistance (DCR): 80mR; .Creator: GP; Resistance: 80m; Inductance: 10uH; DC Current: 1.6A; Source: Filter components.SchLib; Length: 9.2mm; Current Rating: 1.6A; ComponentLink2Description: Where buy it; Design Item ID: CMC_10u_1.6A; Tolerance: 30%; Height: 5mm; RoHS Compliant: Yes; RoHS: Yes; Case/Package: SMD/SMT; Package Quantity: 1; Category: Common Mode Line Filter; Current: 1.6A; Depth: 6.3mm; REACH SVHC: No SVHC; ComponentLink1URL: https://www.we-online.com/catalog/datasheet/744226.pdf; Termination: SMD/SMT; Min Operating Temperature: -40°C; ComponentLink1Description: Datasheet; Width: 6mm; Stock 1: 1943; Lead Free: Lead Free; Series: WE-SL2; ComponentLink2URL: https://www.we-online.com/catalog/en/WE-SL2?sq=744226#744226; Number of Pins: 4; Mount: Surface Mount; Test Frequency: 1kHz; Packaging: Tape and Reel; Pricing 1: 1=2,55000, 10=2,51500, 50=2,27200, 100=2,19100, 500=2,02900 (USD); Voltage Rating (DC): 80V; Weight: 0.017672oz; Max DC Current: 1.6A; Max Operating Temperature: 125°C
R301-R304 = CMP-00080-1: Res Thin Film 0805 60.4 Ohm 0.1% 1/8W ±25ppm/°C Molded SMD SMD Punched Carrier T/R; Manufacturer 1: Panasonic; Manufacturer Part Number 1: ERA-6AEB60R4V; Voltage Rating (DC): 100V; Power Rating: 125mW; Voltage Rating: 200V; .Creator: DR; Lead Free: Lead Free; ComponentLink4URL: https://datasheet.ciiva.com/30184/54aoa0000ce26-30184022.pdf?src-supplier=Onlinecomponents.com; Source: Passives.SchLib; Radiation Hardening: No; ComponentLink5Description: https://datasheet.ciiva.com/9188/aoa0000ce26-9188476.pdf?src-supplier=Avnet; Depth: 1.25mm; Length: 2mm; ComponentLink3Description: https://datasheet.ciiva.com/5951/485442-5951173.pdf?src-supplier=Farnell; RoHS: Yes; Tolerance: 0.1%; Termination: SMD/SMT; ComponentLink1Description: https://datasheet.ciiva.com/11811/0900766b80eb1d8c-11811180.pdf?src-supplier=RSComponents; Max Power Dissipation: 125mW; Package Quantity: 5000; Mount: Surface Mount; Number of Terminations: 2; Temperature Coefficient: 25ppm/°C; Case/Package: 0805; Packaging: Tape and Reel; Contact Plating: Tin; Category: Chip SMD Resistors; ComponentLink1URL: https://datasheet.ciiva.com/11811/0900766b80eb1d8c-11811180.pdf?src-supplier=RSComponents; Features: Automotive AEC-Q200; Weight: 0.000194oz; Resistor Type: Thin Film,Metal Film; Design Item ID: R60-0805FTN; Stock 1: 5000; Case Code (Metric): 2012; ComponentLink2Description: https://datasheet.ciiva.com/41450/001181146-da-01-en-widerstand-era-0805-60r4-0-1-5000st-41450303.pdf?src-supplier=Conrad; ComponentLink4Description: https://datasheet.ciiva.com/30184/54aoa0000ce26-30184022.pdf?src-supplier=Onlinecomponents.com; ComponentLink3URL: https://datasheet.ciiva.com/5951/485442-5951173.pdf?src-supplier=Farnell; Max Operating Temperature: 155°C; Pricing 1: 1=0,04650, 10=0,03900, 100=0,02860 (USD); ComponentLink2URL: https://datasheet.ciiva.com/41450/001181146-da-01-en-widerstand-era-0805-60r4-0-1-5000st-41450303.pdf?src-supplier=Conrad; ComponentLink5URL: https://datasheet.ciiva.com/9188/aoa0000ce26-9188476.pdf?src-supplier=Avnet; Min Operating Temperature: -55°C; Pins: 2; Width: 1.25mm; Height: 0.5mm
U301 = CMP-015-00008-1: Enhanced Automotive dual CAN transceiver with inverted Standby and 1.8-V I/O Support 14-VSON -40 to 150

## Sheet [4]isoSPI.SchDoc
size A4; SheetNumber: 5; SheetTotal: 6
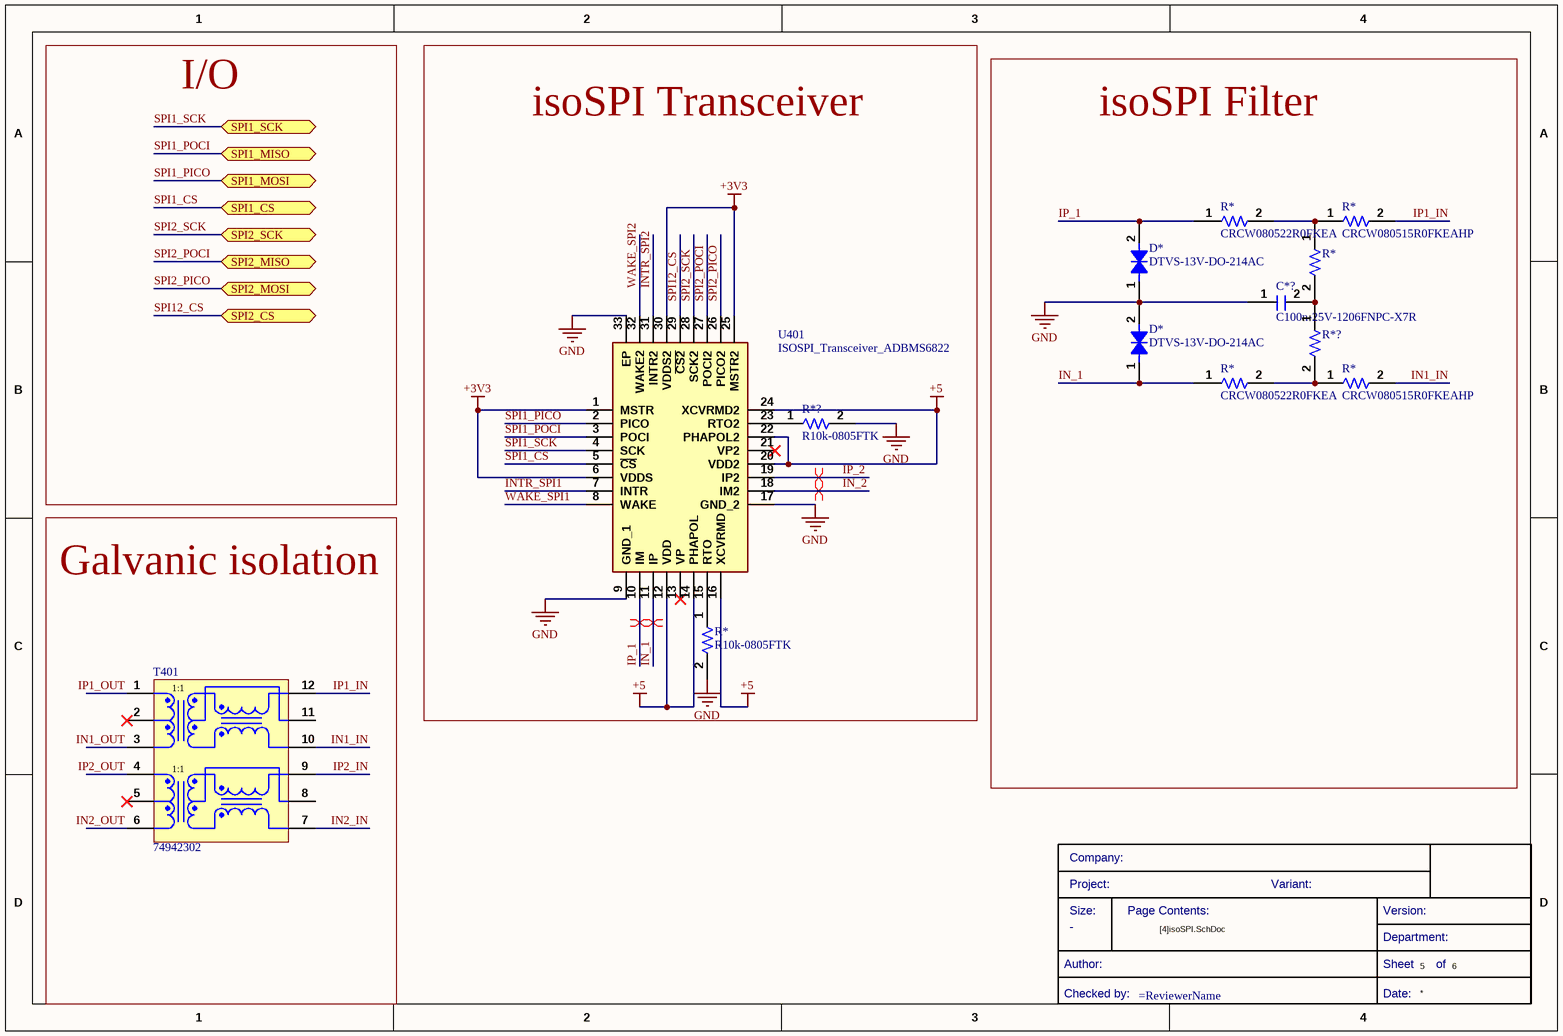
[diagram p3: [4]isoSPI.SchDoc]

### Parts
(Parts that share a designator on the sheet are numbered #1, #2 ... from top to bottom, then left to right.)
?#4  (no value)  (graphical)
C*?  C100n-25V-1206FNPC-X7R  [C1206FNPC-RW]
D*#3  DTVS-13V-DO-214AC  [DTVS-DO-214AC]
D*#4  DTVS-13V-DO-214AC  [DTVS-DO-214AC]
R*#3  CRCW080522R0FKEA  [0805]
R*#4  CRCW080543R2FKEA  [FP-CRCW0805-e3-IPC_A]  (value not drawn)
R*#5  CRCW080515R0FKEAHP  [FP-CRCW0805-HPe3-IPC_B]
R*#6  CRCW080522R0FKEA  [0805]
R*#7  CRCW080515R0FKEAHP  [FP-CRCW0805-HPe3-IPC_B]
R*#8  R10k-0805FTK  [R0805FTK]
R*?#1  CRCW080543R2FKEA  [FP-CRCW0805-e3-IPC_A]  (value not drawn)
R*?#2  R10k-0805FTK  [R0805FTK]
T401  74942302  [WE-BMS_74942302]
U401  ISOSPI_Transceiver_ADBMS6822  [ISOSPI_Transceiver_ADBMS6822]

### Blocks framed on the sheet
isoSPI Transceiver: R*#8 R*?#2 U401
isoSPI Filter: C*? D*#3 D*#4 R*#3-R*#7 R*?#1
Galvanic isolation: T401

### Ports
SPI1_CS (bidir, see Master_uC_PCB.SchDoc[2C], [2]STM32L4[2B]), SPI1_MISO (bidir, see Master_uC_PCB.SchDoc[2C], [2]STM32L4[2B]), SPI1_MOSI (bidir, see Master_uC_PCB.SchDoc[2C], [2]STM32L4[2B]), SPI1_SCK (bidir, see Master_uC_PCB.SchDoc[2C], [2]STM32L4[2B]), SPI2_CS (bidir, see Master_uC_PCB.SchDoc[2C], [2]STM32L4[2C]), SPI2_MISO (bidir, see Master_uC_PCB.SchDoc[2C], [2]STM32L4[2C]), SPI2_MOSI (bidir, see Master_uC_PCB.SchDoc[2C], [2]STM32L4[2C]), SPI2_SCK (bidir, see Master_uC_PCB.SchDoc[2C], [2]STM32L4[2C])

### Nets
+3V3: U401.1(MSTR) U401.6(VDDS) U401.25(MSTR2) U401.30(VDDS2)
+5: U401.12(VDD) U401.14(PHAPOL) U401.16(XCVRMD) U401.20(VDD2) U401.22(PHAPOL2) U401.24(XCVRMD2)
GND: C*?.1 D*#3.1 D*#4.2 R*#8.2 R*?#2.2 U401.9(GND_1) U401.17(GND_2) U401.33(EP)
IN1_IN: R*#7.2 T401.10
IN1_OUT: T401.3
IN2_IN: T401.7
IN2_OUT: T401.6
IN_1: D*#4.1 R*#6.1 U401.11(IP)
IN_2: U401.18(IM2)
INTR_SPI1: U401.7(INTR)
INTR_SPI2: U401.31(INTR2)
IP1_IN: R*#5.2 T401.12
IP1_OUT: T401.1
IP2_IN: T401.9
IP2_OUT: T401.4
IP_1: D*#3.2 R*#3.1 U401.10(IM)
IP_2: U401.19(IP2)
SPI1_CS: U401.5(~{CS}) ; port SPI1_CS
SPI1_PICO: U401.2(PICO) ; port SPI1_MOSI
SPI1_POCI: U401.3(POCI) ; port SPI1_MISO
SPI1_SCK: U401.4(SCK) ; port SPI1_SCK
SPI2_PICO: U401.26(PICO2) ; port SPI2_MOSI
SPI2_POCI: U401.27(POCI2) ; port SPI2_MISO
SPI2_SCK: U401.28(SCK2) ; port SPI2_SCK
SPI12_CS: U401.29(~{CS2}) ; port SPI2_CS
WAKE_SPI1: U401.8(WAKE)
WAKE_SPI2: U401.32(WAKE2)
NetC*?_2: C*?.2 R*#4.2 R*?#1.1
NetR*#3_2: R*#3.2 R*#4.1 R*#5.1
NetR*#6_2: R*#6.2 R*#7.1 R*?#1.2
NetR*#8_1: R*#8.1 U401.15(RTO)
NetR*?#2_1: R*?#2.1 U401.23(RTO2)

Not connected (* = marked no-connect by the designer): T401 2* 5* 8 11; U401 13(VP)* 21(VP2)*

### Layout directives
differential pair: IN_1, IN_2, IP_1, IP_2

### Notes on the sheet
- I/O
- Size:
- Company:
- Project:
- Page Contents:
- Variant:
- Version:
- Checked by:
- Author:
- Sheet
- Date:
- Department:
- of
- (in symbol CMP-00198-1) 1:1

### Library data of the parts
?#4 = CMP-00043-6: Standard Title Block
C*? = CMP-00062-1: Cap Cer 0.1UF 25V X7R 1206; Manufacturer Part Number: 885012208058; Manufacturer: Wurth Electronics; .Creator: DO; Tolerance: 10%; Value: 100nF; Voltage Rating: 25V; RoHS Compliant: Yes; ComponentLink2URL: https://www.we-online.com/catalog/en/WCAP-CSGP-25VDC#885012208058; ComponentLink1Description: Datasheet; RoHS: Yes; Stock 1: 4375; Thickness: 0.035inch; ComponentLink1URL: https://www.we-online.com/catalog/datasheet/885012208058.pdf; Min Operating Temperature: -55°C; Case/Package: 1206; Source: Passives.SchLib; Width: 0.063inch; Packaging: Tape and Reel; Pricing 1: 1=0,11000, 10=0,10100, 100=0,09100, 500=0,08000 (USD); ComponentLink2Description: Where buy it; Length: 0.126inch; ComponentLink3URL: https://katalog.we-online.de/pbs/datasheet/885012208058.pdf?src-supplier=Digi-Key; Case Code (Metric): 3216; Max Operating Temperature: 125°C; Category: Capacitor; ComponentLink3Description: https://katalog.we-online.de/pbs/datasheet/885012208058.pdf?src-supplier=Digi-Key; Mount: Surface Mount; Design Item ID: C100n-25V-1206FNPC-X7R
D*#3 D*#4 = CMP-00155-1: Tvs Diode, 400W, 13V, Bidir, DO-214AC; Manufacturer Part Number: 824501131; Manufacturer: Wurth Electronics; Peak Pulse Current: 18.6A; Power Line Protection: No; .Creator: DO; Forward Voltage: 15.15V; Polarity: Bidirectional; Number of Bidirectional Channels: 1; Clamping Voltage: 21.5V; Max Operating Temperature: 150°C; Category: TVS Diodes; Stock 1: 1000; RoHS: Yes; ComponentLink3Description: Where buy it; Source: Filter components.SchLib; Design Item ID: DTVS-13V-DO-214AC; REACH SVHC: Unknown; Min Operating Temperature: -65°C; Resistor Type: Zener; ComponentLink2Description: http://www.farnell.com/datasheets/2036399.pdf?src-supplier=Element14; Peak Pulse Power: 400W; ComponentLink1URL: https://katalog.we-online.de/pbs/datasheet/824501131.pdf?src-supplier=Digi-Key; Packaging: Cut Tape; ComponentLink2URL: http://www.farnell.com/datasheets/2036399.pdf?src-supplier=Element14; ComponentLink3URL: https://www.we-online.com/catalog/en/WE-TVSP?sq=824501131#824501131; RoHS Compliant: Yes; Reverse Standoff Voltage: 13V; Mount: Surface Mount; Min Breakdown Voltage: 15.15V; ComponentLink1Description: https://katalog.we-online.de/pbs/datasheet/824501131.pdf?src-supplier=Digi-Key; Pricing 1: 1=0,27000 (USD); Pins: 2
R*#3 R*#6 = CMP-009-00017-2: CRCW0805 Resistor T/R 0.125W,1%,22R Vishay CRCW Series Thick Film Surface Mount Resistor 0805 Case 22 +/-1% 0.125W +/-100ppm/C; Geometry.Height: 0.5mm; Manufacturer_Part_Number: CRCW080522R0FKEA; Source: CRCW080522R0FKEA.SchLib; Mouser Part Number: 71-CRCW0805-22-E3; Design Item ID: CRCW080522R0FKEA; Arrow Price/Stock: https://www.arrow.com/en/products/crcw080522r0fkea/vishay; Datasheet Link: http://www.vishay.com/docs/20035/dcrcwe3.pdf; Mouser Price/Stock: https://www.mouser.co.uk/ProductDetail/Vishay-Dale/CRCW080522R0FKEA?qs=fIsz7OpyEY9aZZAJSCbWBw%3D%3D; Manufacturer_Name: Vishay; Arrow Part Number: CRCW080522R0FKEA
R*#4 R*?#1 = CMP-009-00016-1: Fixed Resistor, Metal Glaze/thick Film, 0.125W, 43.2ohm, 150V, 1% +/-Tol, 100ppm/Cel, Surface Mount, 0805; Value: 43.2; Power: 125mW; RoHS Compliant: Yes; Mounting Technology: Surface Mount; Tolerance: 1%; Max Operating Temperature: 155°C; Case/Package: 0805; Min Operating Temperature: -55°C; Pins: 2
R*#5 R*#7 = CMP-009-00012-1: Fixed Resistor, Metal Glaze/thick Film, 0.5W, 15ohm, 150V, 1% +/-Tol, 100ppm/Cel, Surface Mount, 0805; Value: 15; Power: 500mW; Tolerance: 1%; Pins: 2; Mounting Technology: Surface Mount; Case/Package: 0805; Max Operating Temperature: 155°C; Min Operating Temperature: -55°C; RoHS Compliant: Yes
R*#8 R*?#2 = CMP-00085-1: BOURNS         CR0805-JW-103ELF            Surface Mount Chip Resistor, Thick Film, CR Series, 10 kohm, 125 mW,  5%, 150 V; .Creator: DR; Power Rating: 125mW; Voltage Rating (DC): 100V; Voltage Rating: 150V; Temperature Coefficient: 200ppm/°C; Value: 10k; ComponentLink6URL: https://datasheet.ciiva.com/16783/70154685-16783482.pdf?src-supplier=Allied+Electronics; Manufacturer 1: Bourns; Package Quantity: 1; ComponentLink10URL: https://datasheet.ciiva.com/7985/1856384-7985869.pdf?src-supplier=Element14; Technology: THICK FILM; Source: Passives.SchLib; RoHS Compliant: Yes; ComponentLink10Description: https://datasheet.ciiva.com/7985/1856384-7985869.pdf?src-supplier=Element14; ComponentLink1URL: https://datasheet.ciiva.com/11821/0900766b80fcdb72-11821135.pdf?src-supplier=RSComponents; ComponentLink7Description: https://datasheet.ciiva.com/5548/chpreztr-5548491.pdf?src-supplier=Mouser; Radiation Hardening: No; Design Item ID: R10k-0805FTK; ComponentLink4Description: https://datasheet.ciiva.com/7986/691949-7986187.pdf?src-supplier=Element14; Pins: 2; ComponentLink9URL: https://datasheet.ciiva.com/6559/chpreztr-6559901.pdf?src-supplier=Digi-Key; Resistor Type: Thick Film; ComponentLink4URL: https://datasheet.ciiva.com/7986/691949-7986187.pdf?src-supplier=Element14; Contact Plating: Tin; Case Code (Metric): 2012; Military Standard: Not; Depth: 1.25mm; Case/Package: 0805; Packaging: Tape and Reel; ComponentLink9Description: https://datasheet.ciiva.com/6559/chpreztr-6559901.pdf?src-supplier=Digi-Key; Construction: Rectangular; Pricing 1: 1=0,05790, 10=0,01540, 25=0,01340, 100=0,00340 (USD); ComponentLink7URL: https://datasheet.ciiva.com/5548/chpreztr-5548491.pdf?src-supplier=Mouser; Category: Chip SMD Resistors; Length: 2mm; Max Operating Temperature: 155°C; Resistance Tolerance: 5%; Manufacturer Part Number 1: CR0805-JW-103ELF; Height: 0.5mm; ComponentLink2URL: https://datasheet.ciiva.com/9122/chpreztr-9122374.pdf?src-supplier=Avnet; Thickness: 508um; Max Power Dissipation: 125mW; ComponentLink8Description: https://datasheet.ciiva.com/6559/chpreztr-6559900.pdf?src-supplier=Digi-Key; REACH SVHC: No SVHC; ComponentLink8URL: https://datasheet.ciiva.com/6559/chpreztr-6559900.pdf?src-supplier=Digi-Key; ComponentLink5URL: https://datasheet.ciiva.com/30065/159chpreztr-30065976.pdf?src-supplier=Onlinecomponents.com; Width: 1.25mm; ComponentLink11URL: https://datasheet.ciiva.com/48692/001055517-da-01-en-smd-wid-cr0805-jw-103elf-10k-ohm-1-8w-48692118.pdf?src-supplier=Conrad; ComponentLink3Description: https://datasheet.ciiva.com/22693/1902866-22693254.pdf?src-supplier=Element14; ComponentLink11Description: https://datasheet.ciiva.com/48692/001055517-da-01-en-smd-wid-cr0805-jw-103elf-10k-ohm-1-8w-48692118.pdf?src-supplier=Conrad; ComponentLink1Description: https://datasheet.ciiva.com/11821/0900766b80fcdb72-11821135.pdf?src-supplier=RSComponents; ComponentLink2Description: https://datasheet.ciiva.com/9122/chpreztr-9122374.pdf?src-supplier=Avnet; Stock 1: 57566; Min Operating Temperature: -55°C; Series: CR0805; Number of Terminations: 2; Termination: SMD/SMT; Tolerance: 5%; Mount: Surface Mount; ComponentLink6Description: https://datasheet.ciiva.com/16783/70154685-16783482.pdf?src-supplier=Allied+Electronics; ComponentLink5Description: https://datasheet.ciiva.com/30065/159chpreztr-30065976.pdf?src-supplier=Onlinecomponents.com; RoHS: Yes; Features: Moisture Resistant; ComponentLink3URL: https://datasheet.ciiva.com/22693/1902866-22693254.pdf?src-supplier=Element14
T401 = CMP-00198-1: WE-BMS SMT transformer -40°C to +125°C
U401 = CMP-015-00003-1: The ADBMS6821 (single) and ADBMS6822 (dual) provide bidirectional isolated serial port interface (isoSPI™)...